# EAGLE design Truss-Power-V3 (EAGLE 8.4.3)

## Sheet 1 of 2
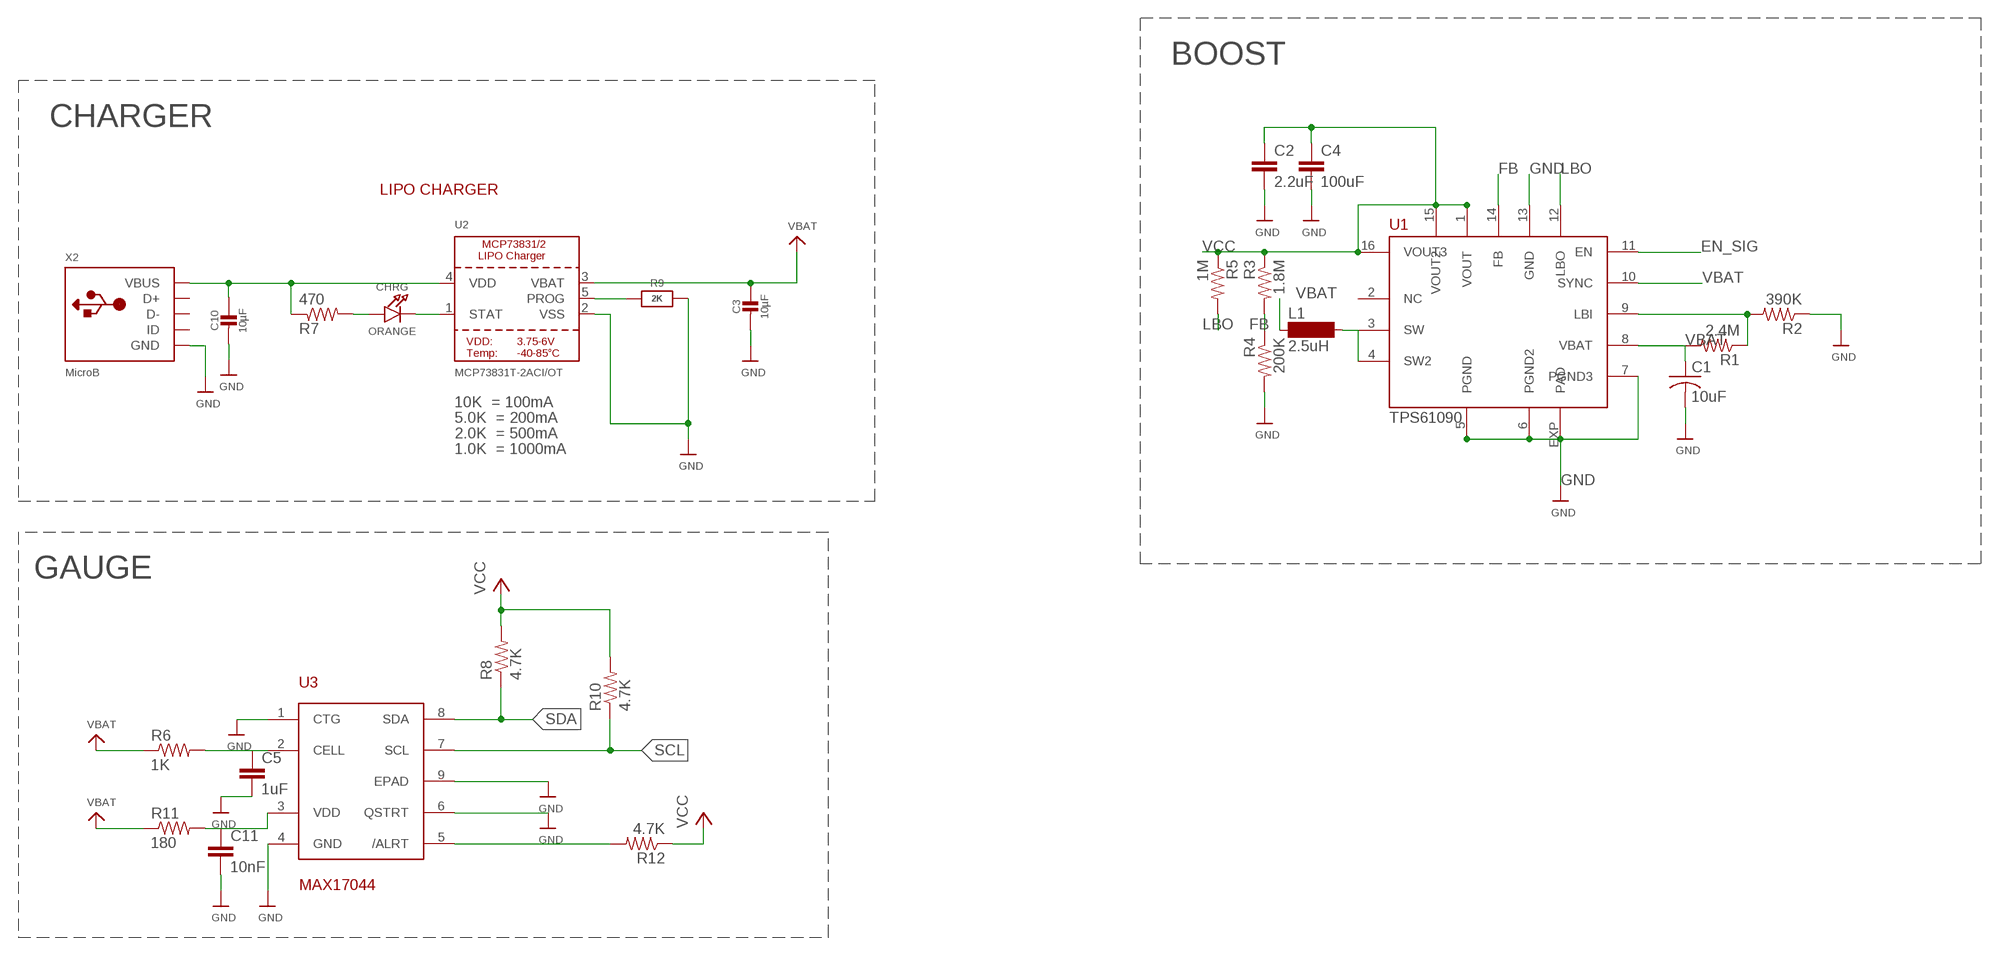
[diagram p0: schematic, sheet 1]

### Parts
C1  10uF  C-USC0805K  [C0805K]
C2  2.2uF  C-EUC0805K  [C0805K]
C3  10µF  CAP_CERAMIC0805-NOOUTLINE  [0805-NO]
C4  100uF  TANT-CAP  [7343-METRIC]
C5  1uF  C-EUC0603  [C0603]
C10  10µF  CAP_CERAMIC0805-NOOUTLINE  [0805-NO]
C11  10nF  C-EUC0603  [C0603]
CHRG  ORANGE  LED0805_NOOUTLINE  [CHIPLED_0805_NOOUTLINE]
L1  2.5uH  CDRH5D28  [CDRH5D28]
R1  2.4M  R-US_R0603  [R0603]
R2  390K  R-US_R0603  [R0603]
R3  1.8M  R-US_R0603  [R0603]
R4  200K  R-US_R0603  [R0603]
R5  1M  R-US_R0603  [R0603]
R6  1K  R-US_R0402  [R0402]
R7  470  R-US_R0402  [R0402]
R8  4.7K  R-US_R0402  [R0402]
R9  2K  RESISTOR0805_NOOUTLINE  [0805-NO]
R10  4.7K  R-US_R0402  [R0402]
R11  180  R-US_R0402  [R0402]
R12  4.7K  R-US_R0402  [R0402]
U1  TPS61090  [TPS61090]
U2  MCP73831T-2ACI/OT  MCP73831/2  [SOT23-5]
U3  MAX17044  [TDFN]
X2  MicroB  USBMICRO_20329  [4UCONN_20329]

### Nets
ALRT: R12.2 U3.5(/ALRT)
EN_SIG: U1.11(EN) ; also sheet 2
FB: R3.2 R4.1 U1.14(FB)
GND: C1.2 C2.2 C3.2 C4.2 C5.2 C10.2 C11.2 R2.1 R4.2 R9.2 U1.5(PGND) U1.6(PGND2) U1.7(PGND3) U1.13(GND) U1.EXP(PAD) U2.2(VSS) U3.1(CTG) U3.4(GND) U3.6(QSTRT) U3.9(EPAD) X2.BASE@1(GND) X2.BASE@2(GND) X2.GND X2.SPRT@1(GND) X2.SPRT@2(GND) X2.SPRT@3(GND) X2.SPRT@4(GND) ; also sheet 2
LBI: R1.1 R2.2 U1.9(LBI)
LBO: R5.2 U1.12(LBO)
N$1: C5.1 R6.2 U3.2(CELL)
N$3: C11.1 R11.2 U3.3(VDD)
N$6: CHRG.A R7.2
N$7: CHRG.C U2.1(STAT)
N$14: R9.1 U2.5(PROG)
SCL: R10.1 U3.7(SCL) ; also sheet 2
SDA: R8.1 U3.8(SDA) ; also sheet 2
SW: L1.2 U1.3(SW) U1.4(SW2)
VBAT: C1.1 C3.1 L1.1 R1.2 R6.1 R11.1 U1.8(VBAT) U1.10(SYNC) U2.3(VBAT) ; also sheet 2
VBUS: C10.1 R7.1 U2.4(VDD) X2.VBUS
VCC: C2.1 C4.1 R3.1 R5.1 R8.2 R10.2 R12.1 U1.1(VOUT) U1.15(VOUT2) U1.16(VOUT3) ; also sheet 2
Unconnected: U1.2(NC) X2.D+ X2.D- X2.ID

### Notes on the sheet
- BOOST
- CHARGER
- LIPO CHARGER
- 10K  = 100mA
- 5.0K  = 200mA
- 2.0K  = 500mA
- 1.0K  = 1000mA
- GAUGE

## Sheet 2 of 2
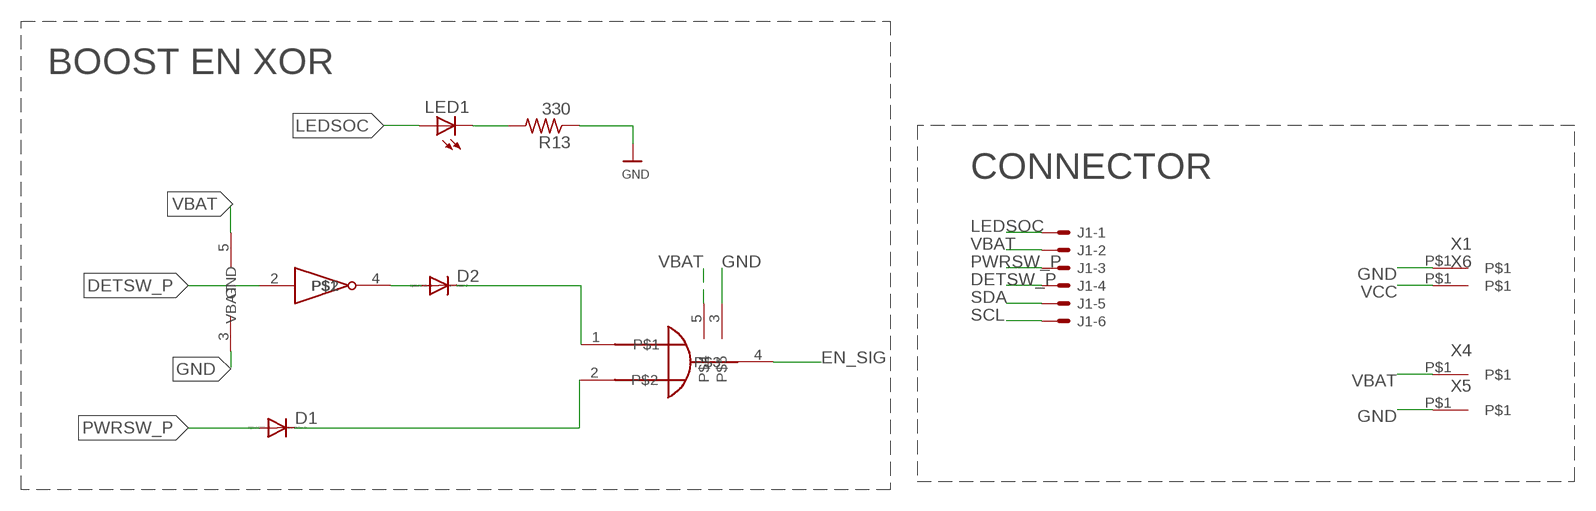
[diagram p1: schematic, sheet 2]

### Parts
D1  DIODE-SOD523  [SOD523]
D2  DIODE-SOD523  [SOD523]
J1  XF2L-0625-1  [XF2L-0625-1]
LED1  LEDCHIP-LED0603  [CHIP-LED0603]
R13  330  R-US_R0402  [R0402]
U4  SN74LVC1G86DC1LR  [SOC70-5]
U$16  INVERTER-GATE  [SOC70-5]
X1  CON-1PIN  [CON-1PIN]
X4  CON-1PIN  [CON-1PIN]
X5  CON-1PIN  [CON-1PIN]
X6  CON-1PIN  [CON-1PIN]

### Nets
DETSW_D: D2.C U4.1
DETSW_P: J1.4 U$16.2
EN_SIG: U4.4 ; also sheet 1
GND: R13.1 U4.3 U$16.3(GND) X1.P$1 X5.P$1 ; also sheet 1
LEDSOC: J1.1 LED1.A
N$4: LED1.C R13.2
N$5: D2.A U$16.4
PWRSW_D: D1.C U4.2
PWRSW_P: D1.A J1.3
SCL: J1.6 ; also sheet 1
SDA: J1.5 ; also sheet 1
VBAT: J1.2 U4.5 U$16.5(VBAT) X4.P$1 ; also sheet 1
VCC: X6.P$1 ; also sheet 1

### Notes on the sheet
- BOOST EN XOR
- CONNECTOR

## Library data of the parts
C1 = adafruit:C-US: CAPACITOR, American symbol
C2 C5 C11 = rcl:C-EU: CAPACITOR, European symbol
C3 C10 = microbuilder:CAP_CERAMIC: Ceramic Capacitors For new designs, use the packages preceded by an '_' character since they are more reliable: The following footprints should be used on most boards: _0402 - Standard footprint for regular board layouts _0603 - Standard footprint for regular board layouts _0805 - Standard footprint for regular board layouts _1206 - Standard footprint for regular board layouts For extremely tight-pitch boards where space is at a premium, the following 'micro-pitch' footprints can be used (smaller pads, no silkscreen outline, etc.): _0402MP - Micro-pitch footprint for very dense/compact boards _0603MP - Micro-pitch footprint for very dense/compact boards _0805MP - Micro-pitch footprint for very dense/compact boards _1206MP - Micro-pitch footprint for very dense/compact boards
C4 = NewPart:TANT-CAP: 7343(Metric) Tantalum Capacitor
CHRG = microbuilder:LED: LED
D1 D2 = diode:DIODE-: DIODE
J1 = con-omron:XF2*-06?: OMRON FPC Connector Source : http://www.omron.com/ecb/products/pdf/fpc.pdf; MF: OMRON COMPONENTS USA; MPN: XF2L-0625-1; OC_FARNELL: 1536105; OC_NEWARK: 29C7842
L1 = NewPart:CDRH5D28: Sumida CDRH5D28 Inductor
LED1 = led:LED: LED
R1-R5 = adafruit:R-US_: RESISTOR, American symbol
R6-R8 R10-R13 = resistor:R-US_: RESISTOR, American symbol
R9 = microbuilder:RESISTOR: Resistors For new designs, use the packages preceded by an '_' character since they are more reliable: The following footprints should be used on most boards: _0402 - Standard footprint for regular board layouts _0603 - Standard footprint for regular board layouts _0805 - Standard footprint for regular board layouts _1206 - Standard footprint for regular board layouts For extremely tight-pitch boards where space is at a premium, the following 'micro-pitch' footprints can be used (smaller pads, no silkscreen outline, etc.): _0402MP - Micro-pitch footprint for very dense/compact boards _0603MP - Micro-pitch footprint for very dense/compact boards _0805MP - Micro-pitch footprint for very dense/compact boards _1206MP - Micro-pitch footprint for very dense/compact boards
U1 = NewPart:TPS61090: TI TPS61090 Boost Regulator
U2 = microbuilder:MCP73831/2: MCP73831/2 LIPO Charger VDD: 3.75 - 6V Temp -40 - 85°C Programmable Charge Rate: 15-500mA NOTE: STAT is a tri-state logic output on the MCP73831 and an open-drain output on the MCP73832. SOT23-5 with 4.2V output and tri-state logic on STAT = MCP73831T-2ACI/OT
U3 = NewPart:MAX17044
U4 = NewPart:SN74LVC1G86DC1LR
U$16 = NewPart:INVERTER-GATE
X1 X4-X6 = NewPart:CON-1PIN: THROUGH HOLE FOR 1-PIN CONNECTOR
X2 = microbuilder:USB: USB Connectors USBMINIB - Surface Mount Female Mini-B USB Connector 4UConnector: 06564

## Board
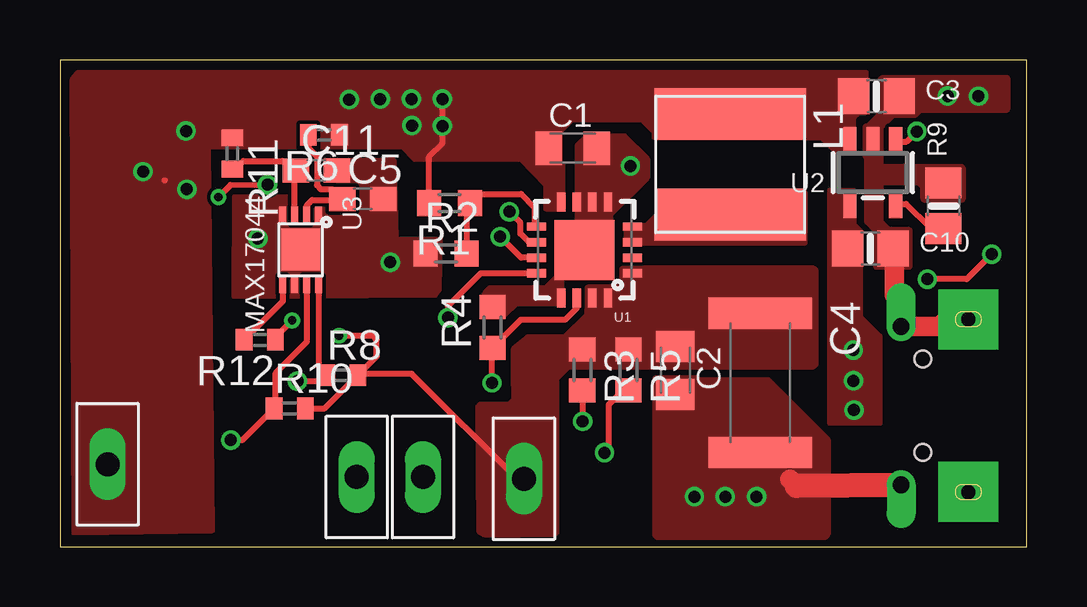
[diagram p2: board, top side]
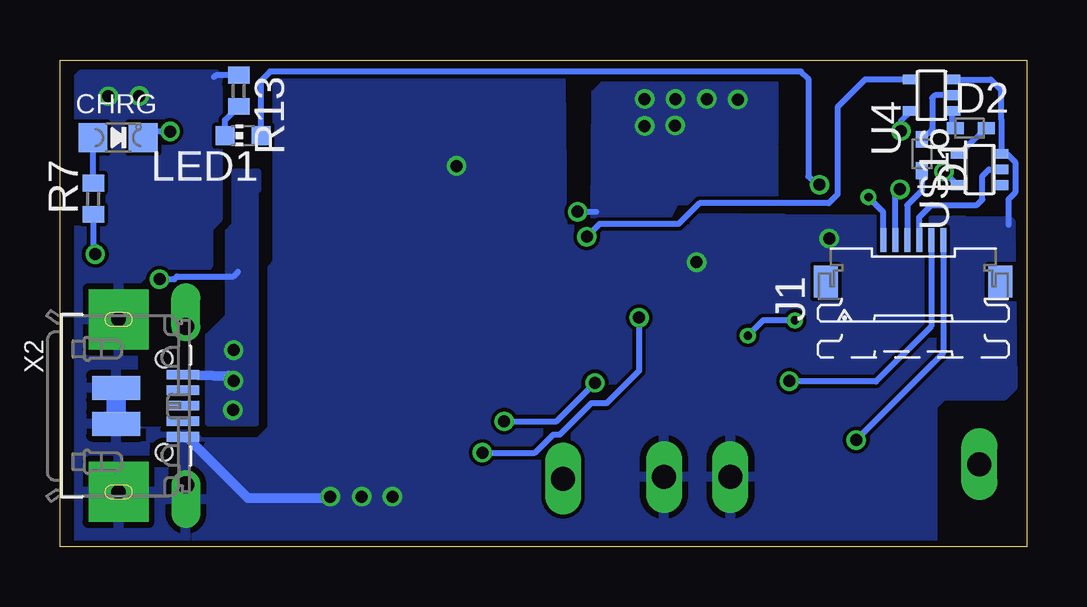
[diagram p3: board, bottom side, seen from below]

Size 40.31 x 20.31 mm. Coordinates in mm from the lower left corner, seen from the top.
Outline: 0,0 40.31,0 40.31,20.31 0,20.31 0,0
Copper layers (1*16): Top 0.035mm / dielectric 1.5mm / Bottom 0.035mm
Design rules "SeeedStudio_2layer_DRU_no_angle_20140221": minimum track width 6mil, minimum drill 12mil, track to track 6mil, track to pad 6mil, pad to pad 6mil, via to via 6mil, smd to smd 0mil, copper to edge 10mil, drill to drill 10mil, minimum pad ring 10mil, minimum via ring 6mil, stop-mask expansion 2mil, vias tented up to drill 100mil, thermal gap 10mil

### Footprints (pad centres in the part's own frame; a part is rotated, then mirrored left to right if it is on the bottom)
C0805K = smd 1.1 x 1.4: 1 -1,0; 2 1,0
C0805K' = smd 1.3 x 1.6: 1 -1,0; 2 1,0
0805-NO = smd 1.3 x 1.5: 1 -0.95,0; 2 0.95,0
7343-METRIC = smd 1.3 x 4.3: 1 -3.4,1.5; 2 2.4,1.5
C0603 = smd 1.1 x 1: 1 -0.85,0; 2 0.85,0
CHIPLED_0805_NOOUTLINE = smd 1.2 x 1.2: A 0,-1.05; C 0,1.05
SOD523 = smd 0.7 x 0.5: A 0.7,0; C -0.6,0
XF2L-0625-1 = smd 1 x 0.25: 1 1.905,1.25; 2 1.905,0.75; 3 1.905,0.25; 4 1.905,-0.25; 5 1.905,-0.75; 6 1.905,-1.25 | smd 1.34 x 1: M1 0.18,3.638; M2 0.18,-3.638
CDRH5D28 = smd 2.15 x 6.3: 1 -2.05,0; 2 2.14,0
CHIP-LED0603 = smd 0.8 x 0.8: A 0,-0.75; C 0,0.75
R0603 = smd 1 x 1.1: 1 -0.85,0; 2 0.85,0
R0402 = smd 0.7 x 0.9: 1 -0.65,0; 2 0.65,0
TPS61090 = smd 0.8 x 0.35: 1 -2,0.975; 2 -2,0.325; 3 -2,-0.325; 4 -2,-0.975; 9 2,-0.975; 10 2,-0.325; 11 2,0.325; 12 2,0.975 | smd 0.35 x 0.8: 5 -0.975,-2; 6 -0.325,-2; 7 0.325,-2; 8 0.975,-2; 13 0.975,2; 14 0.325,2; 15 -0.325,2; 16 -0.975,2 | smd 2.5 x 2.5: EXP 0,0
SOT23-5 = smd 0.55 x 1.2: 1 -0.95,-1.3; 2 0,-1.3; 3 0.95,-1.3; 4 0.95,1.3; 5 -0.95,1.3
TDFN = smd 0.3 x 0.7: 1 -0.75,-1.45; 2 -0.25,-1.45; 3 0.25,-1.45; 4 0.75,-1.45; 5 0.75,1.45; 6 0.25,1.45; 7 -0.25,1.45; 8 -0.75,1.45 | smd 1.63 x 1.75: 9 0,0
SOC70-5 = smd 0.4 x 0.7: 1 -0.65,-0.85; 2 0,-0.85; 3 0.65,-0.85; 4 0.65,0.85; 5 -0.65,0.85
CON-1PIN = drill 1 long: P$1 0,0
4UCONN_20329 = smd 1 x 2: BASE@1 -0.75,-2; BASE@2 0.75,-2 | smd 0.4 x 1.35: D+ 0,0.775; D- -0.65,0.775; GND 1.3,0.775; ID 0.65,0.775; VBUS -1.3,0.775 | drill 0.7 offset: SPRT@1 -3.3,0.9; SPRT@2 3.3,0.9 | drill 0.6 pad 2.5 square: SPRT@3 -3.6,-1.9; SPRT@4 3.6,-1.9 | hole 0.7: -1.95,0; 1.95,0

### Placement (x,y rotation side)
C1  21.37,16.63 0 top
C2  2.2uF  [C0805K']  25.65,7.37 270 top
C3  34.04,18.8 0 top
C4  27.69,6.35 270 top
C5  12.62,14.5 0 top
C10  33.78,12.45 0 top
C11  10.69,15.7 0 top
CHRG  37.89,17.07 270 bottom
D1  4.38,16.4 270 bottom
D2  2.39,17.46 0 bottom
J1  4.74,10.89 90 bottom
L1  27.94,16 270 top
LED1  32.68,17.16 90 bottom
R1  16.24,14.34 180 top
R2  16.09,12.24 0 top
R3  21.77,7.38 270 top
R4  18.03,9.15 90 top
R5  23.7,7.38 270 top
R6  11.01,17.19 180 top
R7  38.92,14.52 90 bottom
R8  11.77,7.16 0 top
R9  36.83,14.22 90 top
R10  9.58,5.78 0 top
R11  7.19,16.41 270 top
R12  8.33,8.64 180 top
R13  32.86,19.02 270 bottom
U1  21.87,12.39 180 top
U2  33.88,15.61 180 top
U3  10.03,12.4 180 top
U4  3.98,18.84 90 bottom
U$16  1.97,15.74 90 bottom
X1  15.13,2.92 0 top
X2  35.97,5.89 270 bottom
X4  1.98,3.45 180 top
X5  12.37,2.92 180 top
X6  19.34,2.85 0 top

### Tracks (layer width: path | path; a pad name or v marks a point on that pad's centre or on a via)
ALRT
  Top 0.254: U3.5 9.28,10.24 R12.2
DETSW_D
  Bottom 0.254: U4.1 3.13,17.6 D2.C
DETSW_P
  Bottom 0.254: J1.4 4.49,13.75 3.98,14.26 2.09,14.26 1.86,14.49 1.86,15.47 1.59,15.74 U$16.2
EN_SIG  (via drill 0.5)
  Top 0.254: U1.11 19.23,12.06 v18.35,12.94
  Bottom 0.254: 4.93,19.49 U4.4 6.75,19.49 7.9,18.34 7.9,14.7 8.26,14.34 13.65,14.34 14.52,13.47 17.82,13.47 v18.35,12.94
FB  (via drill 0.5 pad 0.25)
  Top 0.254: U1.14 21.55,9.96 21.05,9.47 19.2,9.47 R4.1 18.01,8.28 v18.01,6.84 | R3.2 21.77,5.26 v21.79,5.24
  Bottom 0.254: v21.79,5.24 19.61,5.24 v18.01,6.84
GND  (via drill 0.5)
  Top 0.813: C10.2 34.79,12.39 34.79,10.51 35.07,10.23 X2.SPRT@1 36.66,9.19 36.95,9.49 X2.SPRT@3 | 30.72,2.54 30.43,2.83
  Top 1.016: X2.SPRT@2 30.72,2.54
  Bottom 0.254: 0.77,13.44 0.77,14.49 0.49,14.77 0.49,16.06 0.82,16.39 U$16.3 1.06,16.45 1.06,17.83 1.09,17.86 1.09,19.07 1.51,19.49 U4.3 | R13.1 33.82,19.67 33.89,19.6
  Bottom 0.406: X2.GND 34.98,4.54 32.48,2.04 29.1,2.04 v29.04,2.1
  Bottom 0.813: X2.BASE@1 X2.BASE@2
  other vias: 37,18.81 38.29,18.8 13.77,11.87 8.25,12.86 23.78,15.89 26.45,2.1 27.73,2.1
  pour Top (no thermals): 34.33,19.57 39.46,19.57 39.48,19.55 39.48,18.25 39.45,18.22 35.85,18.22 35.64,18.01 34.71,18.01 34.19,17.49 34.19,15.9 34.23,15.86 37.58,15.86 37.63,15.81 37.63,14.51 37.59,14.47 36.04,14.47 35.99,14.52 35.99,15 35.8,15.19 34.21,15.19 34.19,15.17 34.19,13.58 34.54,13.23 35.38,13.23 35.41,13.2 35.41,11.71 35.37,11.67 34.05,11.67 34.04,11.68 34.04,13.16 33.65,13.55 33.65,16.23 33.59,16.29 33.59,17.51 33.61,17.53 33.67,17.53 34.19,18.05 34.19,19.47 34.29,19.57
  pour Top (no thermals): 24.85,7.04 26.56,7.04 26.63,6.97 29.51,6.97 32.01,4.47 32.01,0.53 31.89,0.41 25,0.41 24.9,0.41 24.82,0.49 24.82,7.01
  pour Bottom: 13.82,13.72 13.91,13.23 19.35,13.23 19.37,13.6 19.42,19.53 19.54,19.65 31.13,19.65 31.25,19.53 31.25,11.81 31.47,11.59 31.47,4.92 32.02,4.37 34.45,4.37 34.88,4.8 37.25,4.8 37.25,10.97 36.51,11.71 34.17,11.71 34.12,11.76 34.12,13.33 33.71,13.74 33.71,19.6 33.81,19.7 39.42,19.7 39.52,19.6 39.52,0.29 39.37,0.14 3.86,0.2 3.93,0.27 3.93,5.88 3.48,6.33 0.95,6.33 0.59,6.67 0.68,13.57
  pour Top (no thermals): 22.02,17.14 23.52,17.14 24.46,16.2 24.46,15.39 23.03,13.96 22.93,13.86 22.93,11.35 22.93,11.33 21.04,11.33 20.89,11.18 20.89,10.16 19,10.16 18.55,9.71 17.72,9.71 17.72,10.59 17.92,10.79 20.25,10.79 20.84,11.38 20.81,11.41 20.81,13.46 21.59,13.46 21.59,15.03 21.59,16.75 21.98,17.14
  pour Top (no thermals): 7.3,14.6 9.92,14.6 10.58,14.6 10.89,14.6 10.87,16.13 12.02,16.11 12.58,16.13 13.91,16.1 13.99,12.83 15.83,12.83 15.78,10.74 15.62,10.5 7.27,10.45
LBI
  Top 0.254: R2.2 16.94,14.19 R1.1 17.47,14.72 19.23,14.72 19.79,14.16 19.79,13.44 U1.9 19.83,13.4
LBO  (via drill 0.5)
  Top 0.254: R5.2 23.47,6.53 22.87,5.93 22.87,4.1 v22.7,3.93 | U1.12 17.54,11.41 16.17,10.04 v16.17,9.56
  Bottom 0.254: v22.7,3.93 20.5,3.93 19.74,4.69 19.47,4.69 18.17,5.99 17.53,5.99 16.17,7.35 v16.17,9.56
LEDSOC  (via drill 0.35, 0.5)
  Top 0.254: v6.61,14.59 7.11,15.09 v8.65,15.1
  Bottom 0.254: J1.1 5.99,13.97 v6.61,14.59 | LED1.A 31.95,17.18 31.95,19.43 31.55,19.83 9.42,19.83 9.12,19.53 9.12,15.46 8.76,15.1 v8.65,15.1
N$1
  Top 0.254: R6.2 10.36,16.63 10.71,16.27 10.71,15.08 10.87,14.92 11.36,14.92 C5.1 11.74,14.47 10.52,14.47 10.28,14.24 U3.2
N$3
  Top 0.254: R11.2 7.25,15.7 7.65,16.1 9.28,16.1 9.68,15.7 C11.1 9.78,15.64 U3.3
N$4
  Bottom 0.254: LED1.C 33.43,17.8 R13.2
N$5
  Bottom 0.254: D2.A 2.32,16.89 U$16.4
N$6
  Bottom 0.254: CHRG.A 38.94,15.19 R7.2
N$7  (via drill 0.5)
  Top 0.254: U2.1 35.3,16.91 v35.72,17.33
  Bottom 0.254: 36.45,17.13 CHRG.C 36.58,17.33 v35.72,17.33
N$14
  Top 0.254: U2.5 35.27,14.31 36.26,13.32 36.78,13.32 R9.1
PWRSW_D
  Bottom 0.254: U4.2 3.84,18.84 3.95,18.73 3.95,17.43 D1.C
PWRSW_P
  Bottom 0.254: J1.3 4.99,14.26 4.38,14.87 D1.A
SCL  (via drill 0.5)
  Top 0.254: U3.7 10.28,8.55 8.99,7.26 8.99,5.84 R10.1 7.61,4.46 v7.12,4.46
  Bottom 0.254: 6.83,4.46 v7.12,4.46 3.49,8.09 J1.6
SDA  (via drill 0.5)
  Top 0.254: U3.8 10.78,7.5 11.05,7.22 | 11.05,7.22 R8.1 | v9.9,6.92 10.75,6.92 11.05,7.22
  Bottom 0.254: J1.5 3.99,9.2 6.29,6.9 9.88,6.9 v9.9,6.92
SW
  pour Top (no thermals): 23.66,13.41 24.47,13.41 24.95,13.89 24.95,14.79 31.04,14.79 31.04,12.68 23.64,12.68 23.64,13.41
VBAT  (via drill 0.5)
  Top 0.254: R1.2 15.39,16.28 15.94,16.83 v15.94,18.68 | 4.36,15.29 4.37,15.28 | U1.10 19.55,12.71 19.19,13.07 19.19,13.52 v18.73,13.98
  Bottom 0.254: v5.29,14.92 5.49,14.72 J1.2 | U$16.5 2.9,15.09 v3.46,15.65 | U4.5 5.25,17.77 v5.25,17.35 | v18.73,13.98 17.96,13.98
  other vias: 12.06,18.66 13.35,18.68 14.65,18.68 14.67,17.58 15.94,17.56
  pour Bottom (no thermals): 10.46,19.28 17.7,19.28 18.05,18.93 18.1,13.81 18.01,13.79 14.91,13.79 14.62,14.36 14.59,14.39 12.39,14.38 10.48,14.39
  pour Top (no thermals): 0.59,0.61 6.35,0.7 6.17,16.7 14.27,16.71 14.81,16.17 19.23,16.2 20.26,15.11 20.26,14.12 20.95,14.12 20.95,15.93 20.78,16.1 20.78,17.27 21.35,17.84 24.26,17.84 24.78,17.32 24.78,17.1 31.75,17.1 32.38,16.47 33.08,16.47 33.08,17.9 33.32,18.14 33.6,18.14 33.6,19.76 0.75,19.76 0.51,19.48
VBUS  (via drill 0.5)
  Top 0.254: v38.84,12.21 37.8,11.17 v36.16,11.17
  Bottom 0.254: R7.1 38.92,12.29 v38.84,12.21 | v36.16,11.17 35.55,11.17 35.43,11.28 33.08,11.28 32.89,11.47
  Bottom 0.406: X2.VBUS 33.29,7.14 v33.08,6.93
  other vias: 33.07,8.21 33.1,5.71
  pour Top (no thermals): 32.32,14.87 33.07,14.87 33.07,13.75 33.07,13.45 33.35,13.17 33.35,9.59 34.16,8.78 34.16,5.17 32.11,5.17 32.11,14.87 32.29,14.87
  pour Bottom (no thermals): 32.03,15.64 33.05,15.64 33.05,13.42 33.33,13.14 33.33,9.62 34.15,8.8 34.15,5.17 32.13,5.17 32.13,14.89 32.03,14.89
VCC  (via drill 0.35)
  Top 0.254: R10.2 11.03,5.78 12.36,7.11 R8.2 | R12.1 8.98,8.75 v9.68,9.45 | v11.63,8.81 13.03,8.81 13.21,8.64 13.21,7.96 R8.2 | 19.05,2.83 14.66,7.22 12.47,7.22 R8.2
  Bottom 0.254: v9.68,9.45 11,9.45 v11.63,8.81
  pour Top (no thermals): 18.71,5.93 17.52,5.93 17.42,5.83 17.47,0.66 17.72,0.51 20.63,0.56 20.7,0.63 20.7,7.03 21.2,7.53 31.41,7.53 31.51,7.63 31.51,11.52 31.42,11.61 23.46,11.61 23.42,11.57 23.42,10.84 23.4,10.82 22.01,10.82 21.96,10.77 21.96,9.67 21.04,8.75 19.5,8.74 18.91,8.25 18.9,7.26 18.92,6.14